# Altium schematic sheet delay_channel.SchDoc: Fine Delay FMC
size 297 x 209 mm; CheckedBy: B. Civel; CompanyName: CERN; DrawnBy: TW, GK; Engineer: TW; Organization: CERN; Address1: European Organization for Nuclear Research; Address2: CH-1211 Geneve 23 - Switzerland; DocumentNumber: 8; Revision: -; SheetNumber: 8; SheetTotal: 10; ModifiedBy: B. Civel; CreateDate: 13/07/2011; CheckedDate: 06/06/2013; Title2: Programmable delay line; DivGrp: BE-CO; Designer: TW, GK; Projet: Fine Delay FMC (FMCDel1ns4cha); EDA_Number: EDA-02267-V6-1; ModifiedDate: 16/08/2012
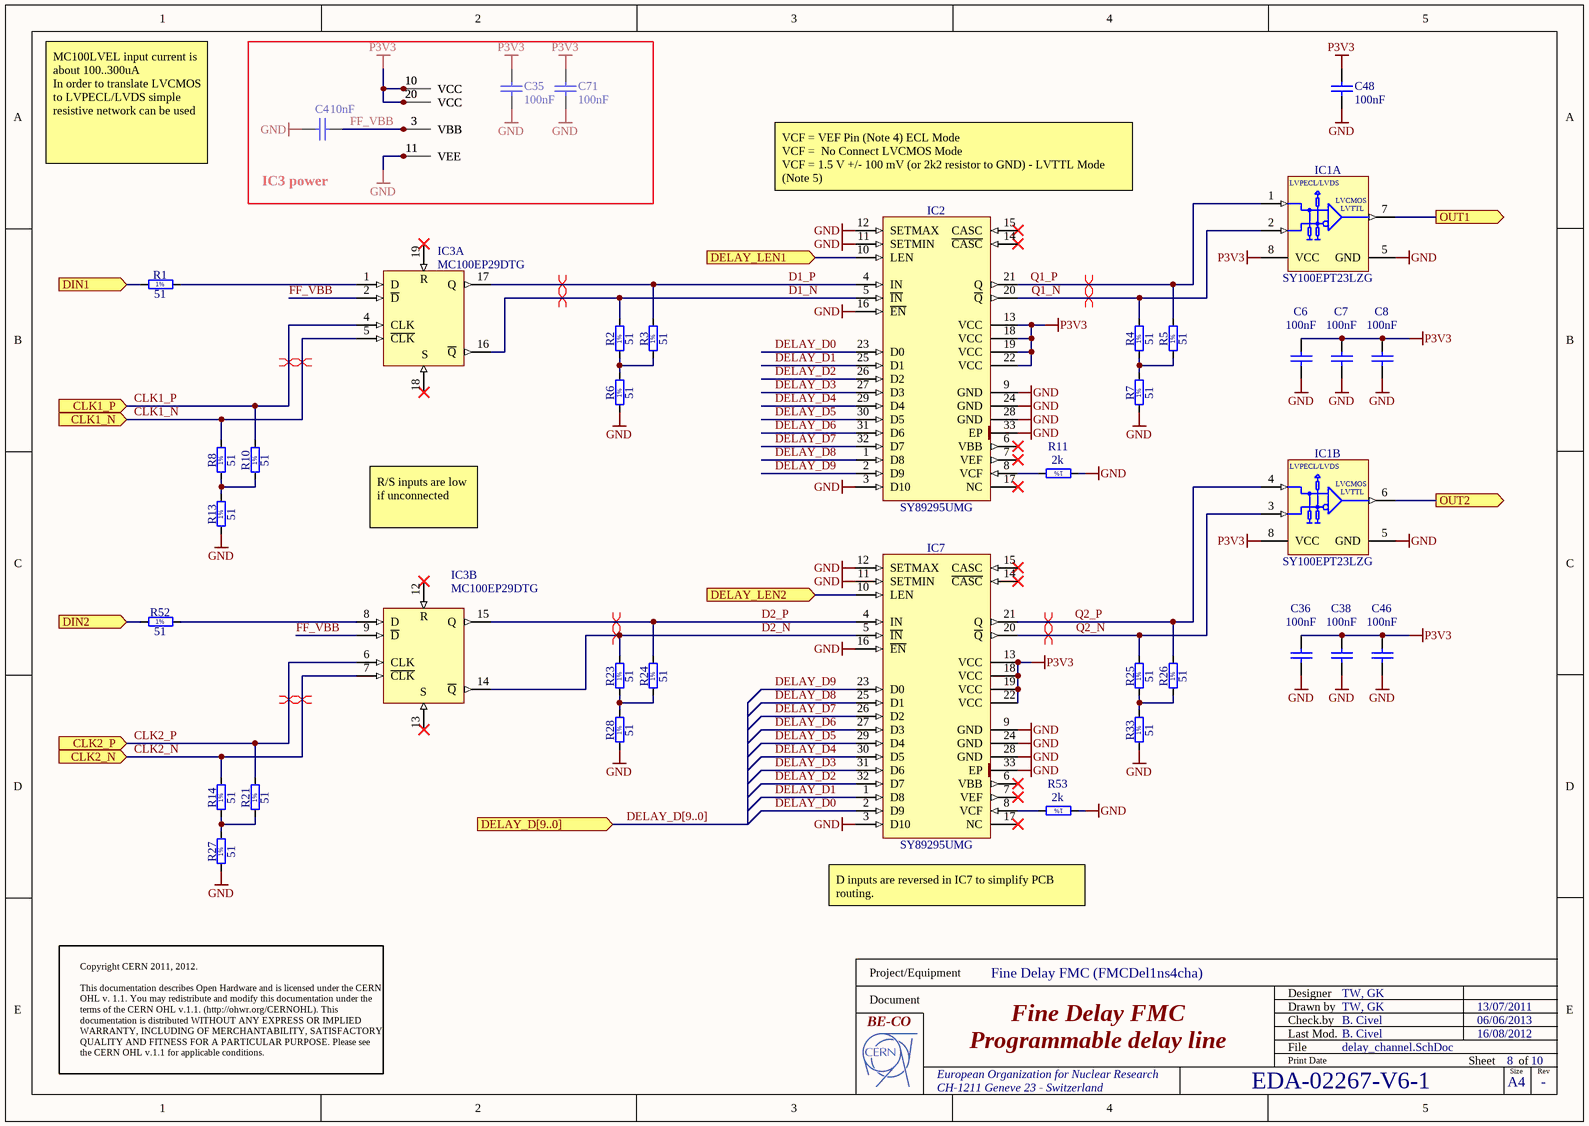
[diagram p0: delay_channel.SchDoc]

## Parts
C4  10nF  [CAPC1608X87N]
C6  100nF  [CAPC1608X87N]
C7  100nF  [CAPC1608X87N]
C8  100nF  [CAPC1608X87N]
C35  100nF  [CAPC1608X87N]
C36  100nF  [CAPC1608X87N]
C38  100nF  [CAPC1608X87N]
C46  100nF  [CAPC1608X87N]
C48  100nF  [CAPC1608X87N]
C71  100nF  [CAPC1608X87N]
IC1  SY100EPT23LZG  [SOIC127P600X175-8N]  (parts A,B of 2)
IC2  SY89295UMG  [QFN50P500X500X90-33N-S320]
IC3  MC100EP29DTG  [SOP65P640X120-20N]  (parts A,B of 2)
IC7  SY89295UMG  [QFN50P500X500X90-33N-S320]
R1  51  [RESC1608X55N]
R2  51  [RESC1608X55N]
R3  51  [RESC1608X55N]
R4  51  [RESC1608X55N]
R5  51  [RESC1608X55N]
R6  51  [RESC1608X55N]
R7  51  [RESC1608X55N]
R8  51  [RESC1608X55N]
R10  51  [RESC1608X55N]
R11  2k  [RESC1608X55N]
R13  51  [RESC1608X55N]
R14  51  [RESC1608X55N]
R21  51  [RESC1608X55N]
R23  51  [RESC1608X55N]
R24  51  [RESC1608X55N]
R25  51  [RESC1608X55N]
R26  51  [RESC1608X55N]
R27  51  [RESC1608X55N]
R28  51  [RESC1608X55N]
R33  51  [RESC1608X55N]
R52  51  [RESC1608X55N]
R53  2k  [RESC1608X55N]

## Blocks framed on the sheet
IC3 power: C4 C35 C71

## Ports
CLK1_N (in), CLK1_P (in), CLK2_N (in), CLK2_P (in), DELAY_D[9..0] (in), DELAY_LEN1 (in), DELAY_LEN2 (in), DIN1 (in), DIN2 (in), OUT1 (out), OUT2 (out)

## Nets
GND: C4.2 C6.2 C7.2 C8.2 C35.1 C36.2 C38.2 C46.2 C48.2 C71.1 IC1.5(GND) IC2.3(D10) IC2.9(GND) IC2.11(SETMIN) IC2.12(SETMAX) IC2.16(~{EN}) IC2.24(GND) IC2.28(GND) IC2.33(EP) IC3.11(VEE) IC7.3(D10) IC7.9(GND) IC7.11(SETMIN) IC7.12(SETMAX) IC7.16(~{EN}) IC7.24(GND) IC7.28(GND) IC7.33(EP) R6.1 R7.1 R11.1 R13.1 R27.1 R28.1 R33.1 R53.1
P3V3: C6.1 C7.1 C8.1 C35.2 C36.1 C38.1 C46.1 C48.1 C71.2 IC1.8(VCC) IC2.13(VCC) IC2.18(VCC) IC2.19(VCC) IC2.22(VCC) IC3.10(VCC) IC3.20(VCC) IC7.13(VCC) IC7.18(VCC) IC7.19(VCC) IC7.22(VCC)
CLK1_N: IC3.5(~{CLK}) R8.2 ; port CLK1_N
CLK1_P: IC3.4(CLK) R10.2 ; port CLK1_P
CLK2_N: IC3.7(~{CLK}) R14.2 ; port CLK2_N
CLK2_P: IC3.6(CLK) R21.2 ; port CLK2_P
D1_N: IC2.5(~{IN}) IC3.16(~{Q}) R2.2
D1_P: IC2.4(IN) IC3.17(Q) R3.2
D2_N: IC3.14(~{Q}) IC7.5(~{IN}) R23.2
D2_P: IC3.15(Q) IC7.4(IN) R24.2
DELAY_D0: IC2.23(D0) IC7.2(D9)
DELAY_D1: IC2.25(D1) IC7.1(D8)
DELAY_D2: IC2.26(D2) IC7.32(D7)
DELAY_D3: IC2.27(D3) IC7.31(D6)
DELAY_D4: IC2.29(D4) IC7.30(D5)
DELAY_D5: IC2.30(D5) IC7.29(D4)
DELAY_D6: IC2.31(D6) IC7.27(D3)
DELAY_D7: IC2.32(D7) IC7.26(D2)
DELAY_D8: IC2.1(D8) IC7.25(D1)
DELAY_D9: IC2.2(D9) IC7.23(D0)
DELAY_LEN1: IC2.10(LEN) ; port DELAY_LEN1
DELAY_LEN2: IC7.10(LEN) ; port DELAY_LEN2
DIN1: R1.2 ; port DIN1
DIN2: R52.2 ; port DIN2
FF_VBB: C4.1 IC3.2(~{D}) IC3.3(VBB) IC3.9(~{D})
OUT1: IC1.7(Q0) ; port OUT1
OUT2: IC1.6(Q0) ; port OUT2
Q1_N: IC1.2(~{D0}) IC2.20(~{Q}) R4.2
Q1_P: IC1.1(D0) IC2.21(Q) R5.2
Q2_N: IC1.3(~{D0}) IC7.20(~{Q}) R25.2
Q2_P: IC1.4(D0) IC7.21(Q) R26.2
NetIC2_8: IC2.8(VCF) R11.2
NetIC3_1: IC3.1(D) R1.1
NetIC3_8: IC3.8(D) R52.1
NetIC7_8: IC7.8(VCF) R53.2
NetR2_1: R2.1 R3.1 R6.2
NetR4_1: R4.1 R5.1 R7.2
NetR8_1: R8.1 R10.1 R13.2
NetR14_1: R14.1 R21.1 R27.2
NetR23_1: R23.1 R24.1 R28.2
NetR25_1: R25.1 R26.1 R33.2

Not connected (* = marked no-connect by the designer): IC2 6(VBB)* 7(VEF)* 14(~{CASC})* 15(CASC)* 17(NC)*; IC3 12(R)* 13(S)* 18(S)* 19(R)*; IC7 6(VBB)* 7(VEF)* 14(~{CASC})* 15(CASC)* 17(NC)*

## Buses and harness runs
bus DELAY_D[9..0] = port DELAY_D[9..0]

## Layout directives
differential pair: CLK1_N, CLK1_P, CLK2_N, CLK2_P, D1_N, D1_P, D2_N, D2_P, Q1_N, Q1_P, Q2_N, Q2_P

## Notes on the sheet
- MC100LVEL input current is about 100..300uA
  In order to translate LVCMOS to LVPECL/LVDS simple resistive network can be used
- (near IC2) VCF = VEF Pin (Note 4) ECL Mode
  VCF =  No Connect LVCMOS Mode
  VCF = 1.5 V +/- 100 mV (or 2k2 resistor to GND) - LVTTL Mode (Note 5)
- (near IC3) R/S inputs are low if unconnected
- D inputs are reversed in IC7 to simplify PCB routing.
- Copyright CERN 2011, 2012.
  This documentation describes Open Hardware and is licensed under the CERN OHL v. 1.1. You may redistribute and modify this documentation under the terms of the CERN OHL v.1.1. (http://ohwr.org/CERNOHL). This documentation is distributed WITHOUT ANY EXPRESS OR IMPLIED WARRANTY, INCLUDING OF MERCHANTABILITY, SATISFACTORY QUALITY AND FITNESS FOR A PARTICULAR PURPOSE. Please see the CERN OHL v.1.1 for applicable conditions.
- Project/Equipment
- Document
- Designer
- Drawn by
- Check.by
- File
- Last Mod.
- Print Date
- Sheet
- Size
- A4
- of
- Rev
- (in symbol R0603_2K_1%_0.1W_100PPM) 1%
- (in symbol R0603_51R_1%_0.1W_100PPM) 1%
- (in symbol SY100EPT23LZG, part A) LVPECL/LVDS; LVCMOS; LVTTL
- (in symbol SY100EPT23LZG, part B) LVPECL/LVDS; LVCMOS; LVTTL

## Library data of the parts
C4 = CC0603_10NF_50V_10%_X7R: Non-polarised capacitor; Part Description: SMD Multilayer Chip Ceramic Capacitor; Manufacturer: GENERIC; Manufacturer1 Part Number: 223858615636; Voltage: 50V; TC: X7R; Tolerance: ±10%; Table: Capacitors SMD; Part Number: CC0603_10NF_50V_10%_X7R; Component Kind: Standard; Component Type: Standard; Pin Count: 2; Value: 10nF; Status: Preferred; Manufacturer Part Number: CC0603_10NF_50V_10%_X7R; Case: 0603; Mounted: Yes; Socket: No; SMD: Yes; Manufacturer1 Example: PHYCOMP; Manufacturer1 ComponentHeight: 0.87mm; HelpURL: \\cern.ch\dfs\Applications\Altium\Datasheets\CC0603_X7R_PHYCOMP.pdf; Author: CERN DEM JLC; CreateDate: 03/12/2007; LatestRevisionDate: 03/12/2007
C6-C8 C35 C36 C38 C46 C48 C71 = CC0603_100NF_50V_10%_X7R: Non-polarised capacitor; Manufacturer1 Part Number: 223858615649; Manufacturer: GENERIC; Part Description: SMD Multilayer Chip Ceramic Capacitor; Table: Capacitors SMD; TC: X7R; Tolerance: ±10%; Voltage: 50V; Author: CERN DEM JLC; Component Type: Standard; CreateDate: 03/12/2007; HelpURL: \\cern.ch\dfs\Applications\Altium\Datasheets\CC0603_X7R_PHYCOMP.pdf; LatestRevisionDate: 03/12/2007; Manufacturer1 ComponentHeight: 0.87mm; Manufacturer1 Example: PHYCOMP; Manufacturer Part Number: CC0603_100NF_50V_10%_X7R; Mounted: Yes; Pin Count: 2; SMD: Yes; Socket: No; Status: Preferred; Value: 100nF; Part Number: CC0603_100NF_50V_10%_X7R; Component Kind: Standard; Case: 0603
IC1 = SY100EPT23LZG: 3.3V Dual Differential LVPECL/LVDS/CML  to LVTTL/LVCMOS Translator; Manufacturer: MICREL; Table: Standard Logic; PressFit: No; Bonding: No; Part Number: SY100EPT23LZG; Component Kind: Standard; Component Type: Standard; Device: SY100EPT23LZG; PackageDescription: SOIC 8, Pitch 1.27mm - Body 4x5mm, IPC Medium Density; Part Description: 3.3V Dual Differential LVPECL/LVDS/CML To LVTTL/LVCMOS Translator; Manufacturer Part Number: SY100EPT23LZG; Pin Count: 8; Case: SOIC8; Mounted: Yes; Socket: No; SMD: Yes; ComponentHeight: 1.73mm; Author: CERN DEM JLC; HelpURL: \\cern.ch\dfs\Applications\Altium\Datasheets\SY100EPT23LZG.pdf; CreateDate: 17/01/2011; LatestRevisionDate: 17/01/2011
IC2 IC7 = SY89295UMG: 2.5V/3.3V 1.5GHz Precision LVPECL Programmable Delay; Manufacturer: MICREL; Table: Analog & Interface; PressFit: No; Bonding: No; Part Number: SY89295UMG; Component Kind: Standard; Component Type: Standard; Device: SY89295UMG; PackageDescription: QFN, (MO-220-VHHD-4) 0.50mm pitch,square; 8 pin X 8 pin, 5mm X 5mm X 1.00mm H body (w/thermal tab 3.2 X 3.2mm),  IPC Medium Density; Part Description: 2.5V/3.3V 1.5GHz Precision LVPECL Programmable Delay; Manufacturer Part Number: SY89295UMG; Pin Count: 32; Case: QFN32; Mounted: Yes; Socket: No; SMD: Yes; ComponentHeight: 1mm; Author: CERN DEM JLC; HelpURL: \\cern.ch\dfs\Applications\Altium\Datasheets\SY89295UMG.pdf; CreateDate: 04/05/2011; LatestRevisionDate: 04/05/2011
IC3 = MC100EP29DTG: 3.3V/5V ECL Dual Differential Data and Clock D Flip-Flop With Set and Reset; Manufacturer: ON SEMICONDUCTOR; Table: Standard Logic; PressFit: No; Bonding: No; Part Number: MC100EP29DTG; Component Kind: Standard; Component Type: Standard; Device: MC100EP29DTG; PackageDescription: SOP, 20-Leads, Body 6.5x4.4mm, Pitch 0.65mm, IPC Medium Density; Part Description: 3.3V/5V ECL Dual Differential Data And Clock D Flip-Flop With Set and Reset; Manufacturer Part Number: MC100EP29DTG; Pin Count: 20; Case: TSSOP20; Mounted: Yes; Socket: No; SMD: Yes; ComponentHeight: 1.2mm; Author: CERN DEM JLC; HelpURL: \\cern.ch\dfs\Applications\Altium\Datasheets\MC100EP29DTG.pdf; CreateDate: 12/01/2011; LatestRevisionDate: 12/01/2011
R1-R8 R10 R13 R14 R21 R23-R28 R33 R52 = R0603_51R_1%_0.1W_100PPM: Resistor - 1%; Part Description: General Purpose Thick Film Chip Resistor; Manufacturer: GENERIC; Manufacturer1 Part Number: NRC06F51R0TRF; Power: 0.1W; TC: ±100ppm/°C; Table: Resistors SMD; Part Number: R0603_51R_1%_0.1W_100PPM; Component Kind: Standard; Component Type: Standard; Pin Count: 2; Value: 51; Status: Preferred; Tolerance: ±1%; Manufacturer Part Number: R0603_51R_1%_0.1W_100PPM; Case: 0603; Mounted: Yes; Socket: No; SMD: Yes; Manufacturer1 Example: NIC COMPONENT; Manufacturer1 ComponentHeight: 0.55mm; HelpURL: \\cern.ch\dfs\Applications\Altium\Datasheets\R0603_NIC_NRC.pdf; Author: CERN DEM JLC; CreateDate: 12/3/2007; LatestRevisionDate: 3/13/2008
R11 R53 = R0603_2K_1%_0.1W_100PPM: Resistor - 1%; Part Description: General Purpose Thick Film Chip Resistor; Manufacturer: GENERIC; Manufacturer1 Part Number: NRC06F2001TRF; Power: 0.1W; TC: ±100ppm/°C; Table: Resistors SMD; Part Number: R0603_2K_1%_0.1W_100PPM; Component Kind: Standard; Component Type: Standard; Pin Count: 2; Value: 2k; Status: Preferred; Tolerance: ±1%; Manufacturer Part Number: R0603_2K_1%_0.1W_100PPM; Case: 0603; Mounted: Yes; Socket: No; SMD: Yes; Manufacturer1 Example: NIC COMPONENT; Manufacturer1 ComponentHeight: 0.55mm; HelpURL: \\cern.ch\dfs\Applications\Altium\Datasheets\R0603_NIC_NRC.pdf; Author: CERN DEM JLC; CreateDate: 12/3/2007; LatestRevisionDate: 3/13/2008